# Altium project PCB_Project_2.PrjPcb
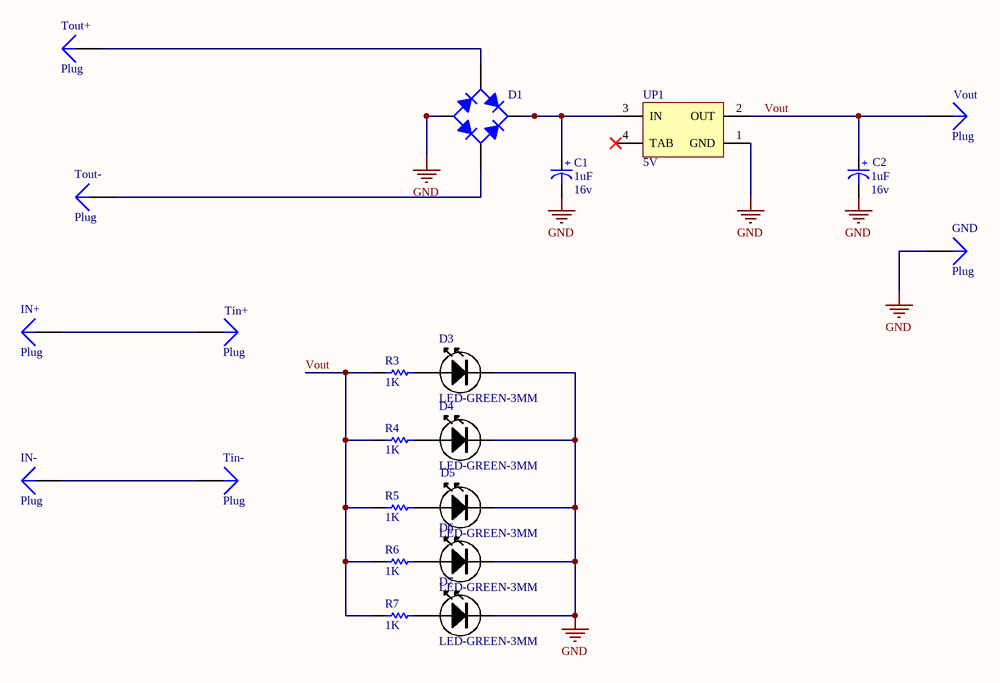
[diagram p0: Sheet2.SchDoc]
1 sheet, 22 parts. Net scope: global (net labels, ports and power ports of the same name join across sheets).
Board file: PCB2.PcbDoc

## Sheet Sheet2.SchDoc
size A; SheetNumber: 1; SheetTotal: 1

### Parts
C1  value 1uF  Voltage: 16v  [cap-ele-02.]  (hidden comment: Capacitor_Ele)
C2  value 1uF  Voltage: 16v  [cap-ele-02.]  (hidden comment: Capacitor_Ele)
D1  Bridge SMD Package  [Bridge SMD Package]  (value not drawn)
D3  LED-GREEN-3MM  [LED-3MM-GREEN]
D4  LED-GREEN-3MM  [LED-3MM-GREEN]
D5  LED-GREEN-3MM  [LED-3MM-GREEN]
D6  LED-GREEN-3MM  [LED-3MM-GREEN]
D7  LED-GREEN-3MM  [LED-3MM-GREEN]
GND  Plug  [PIN1]
IN+  Plug  [PIN1]
IN-  Plug  [PIN1]
R3  value 1K  [Resistor_SMD_0603]  (hidden comment: Resistor 0.25w)
R4  value 1K  [Resistor_SMD_0603]  (hidden comment: Resistor 0.25w)
R5  value 1K  [Resistor_SMD_0603]  (hidden comment: Resistor 0.25w)
R6  value 1K  [Resistor_SMD_0603]  (hidden comment: Resistor 0.25w)
R7  value 1K  [Resistor_SMD_0603]  (hidden comment: Resistor 0.25w)
Tin+  Plug  [PIN1]
Tin-  Plug  [PIN1]
Tout+  Plug  [PIN1]
Tout-  Plug  [PIN1]
UP1  5V  [SOT223_N]
Vout  Plug  [PIN1]

### Nets
GND: C1.2(-) C2.2(-) D1.4(-) D3.K D4.K D5.K D6.K D7.K GND.1 UP1.1(GND)
Vout: C2.1(+) R3.2 R4.2 R5.2 R6.2 R7.2 UP1.2(OUT) Vout.1
NetC1_1: C1.1(+) D1.1(+) UP1.3(IN)
NetD1_2: D1.2(AC) Tout+.1
NetD1_3: D1.3(AC) Tout-.1
NetD3_A: D3.A R3.1
NetD4_A: D4.A R4.1
NetD5_A: D5.A R5.1
NetD6_A: D6.A R6.1
NetD7_A: D7.A R7.1
NetIN+_1: IN+.1 Tin+.1
NetIN-_1: IN-.1 Tin-.1

Not connected (* = marked no-connect by the designer): UP1 4(TAB)*

### Library data of the parts
C1 C2 = Capacitor_Ele.: LatestRevisionDate: 17-Jul-2002; LatestRevisionNote: Re-released for DXP Platform.; Publisher: Altium Limited
R3-R7 = Resistor: LatestRevisionDate: 17-Jul-2002; LatestRevisionNote: Re-released for DXP Platform.; Publisher: Altium Limited
UP1 = AMS1117-x.x: x.x Volt, 800mA Low-Dropout Linear Regulator, 4-pin SOT-223; Designer: Ali Hafizi; Data: 16-12-2016
GND IN+ IN- Tin+ Tin- Tout+ Tout- Vout = Plug: Publisher: Altium Limited
  GND Tout+ Tout- Vout: LatestRevisionDate: 17-Jul-2002; LatestRevisionNote: Re-released for DXP Platform.
  IN+ IN- Tin+ Tin-: Revision: 17-Jul-2002: Re-released for DXP Platform.